# EAGLE schematic Sensor Board@0d0ac80375c143579a8476edc31a75d1 (EAGLE 6.4)

## Sheet 1 of 7: Microcontroller
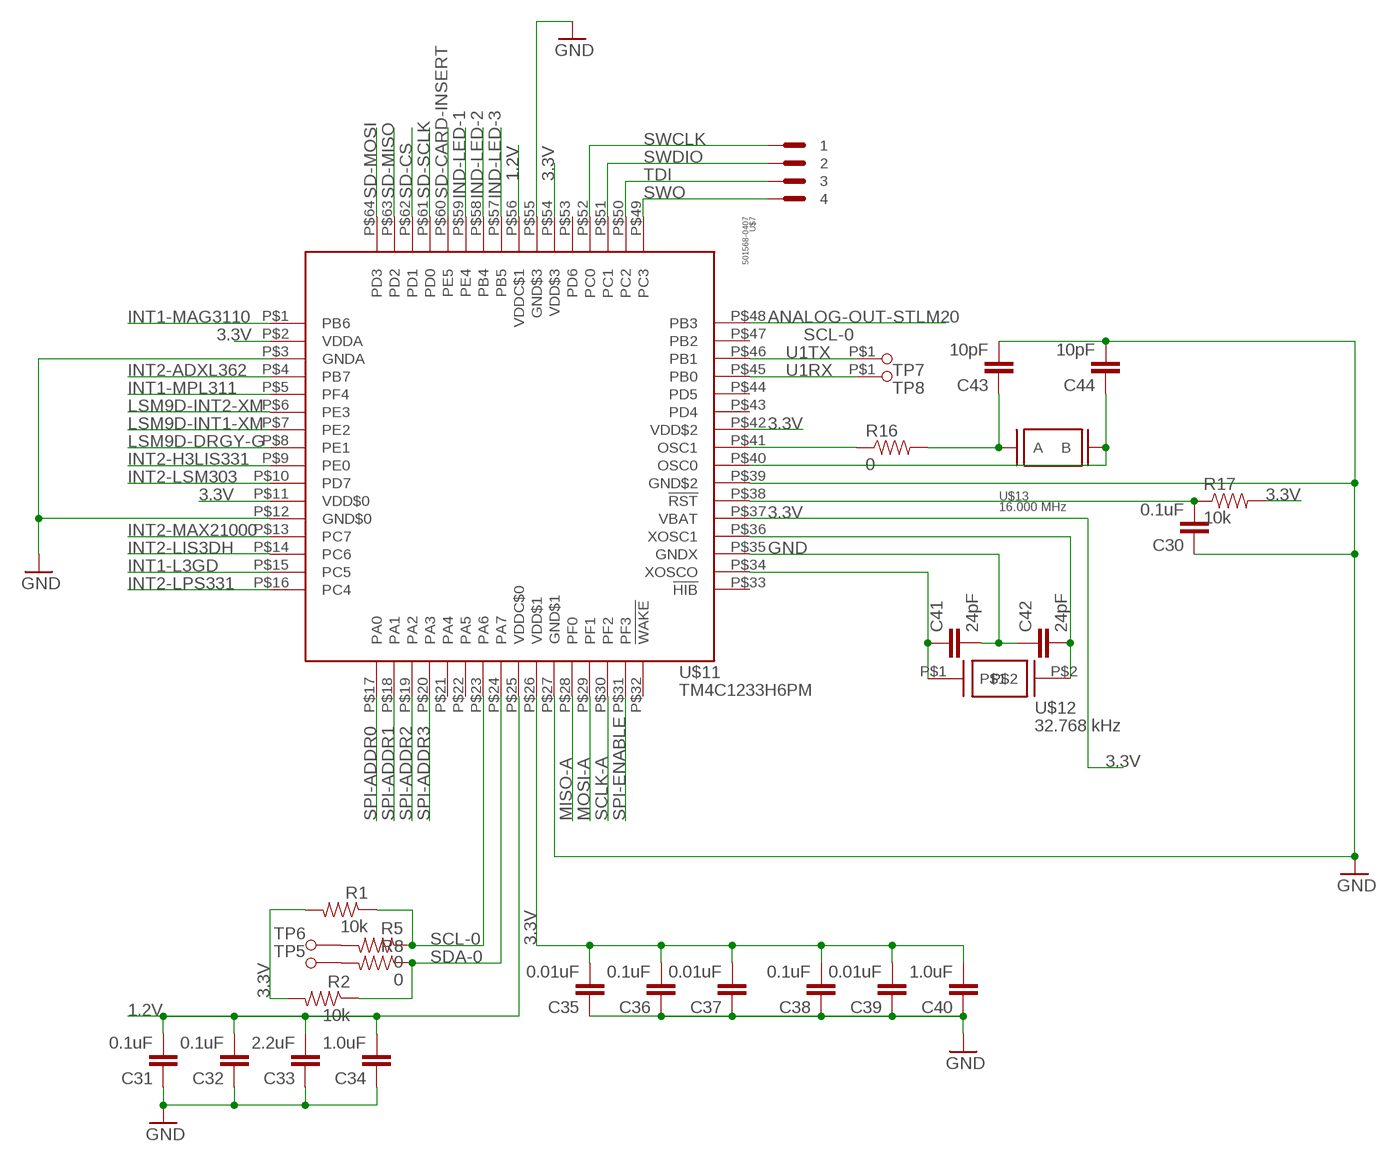
[diagram p0: schematic, sheet 1]

### Parts
C30  0.1uF  CAPACITOR0402  [C0402]
C31  0.1uF  CAPACITOR0402  [C0402]
C32  0.1uF  CAPACITOR0402  [C0402]
C33  2.2uF  CAPACITOR0402  [C0402]
C34  1.0uF  CAPACITOR0402  [C0402]
C35  0.01uF  CAPACITOR0402  [C0402]
C36  0.1uF  CAPACITOR0402  [C0402]
C37  0.01uF  CAPACITOR0402  [C0402]
C38  0.1uF  CAPACITOR0402  [C0402]
C39  0.01uF  CAPACITOR0402  [C0402]
C40  1.0uF  CAPACITOR0402  [C0402]
C41  24pF  CAPACITOR0402  [C0402]
C42  24pF  CAPACITOR0402  [C0402]
C43  10pF  CAPACITOR0402  [C0402]
C44  10pF  CAPACITOR0402  [C0402]
R1  10k  RESISTOR  [R0402]
R2  10k  RESISTOR  [R0402]
R5  0  RESISTOR  [R0402]
R8  0  RESISTOR  [R0402]
R16  0  RESISTOR  [R0402]
R17  10k  RESISTOR  [R0402]
TP5  TESTPAD(ROUND)  [TESTPAD(ROUND)]
TP6  TESTPAD(ROUND)  [TESTPAD(ROUND)]
TP7  TESTPAD(ROUND)  [TESTPAD(ROUND)]
TP8  TESTPAD(ROUND)  [TESTPAD(ROUND)]
U$7  501568-0407  [501568-0407]
U$11  TM4C1233H6PM  [S-PQFP-G64]
U$12  32.768 kHz  ABS07L  [2-SMD(3.2X1.5)]
U$13  16.000 MHz  NX3225GA  [4-SMD(3.2X2.5)]

### Nets
1.2V: C31.2 C32.2 C33.2 C34.2 U$11.P$25(VDDC$0) U$11.P$56(VDDC$1) ; also sheet 7
3.3V: C35.2 C36.2 C37.2 C38.2 C39.2 C40.2 R1.2 R2.2 R17.2 U$11.P$2(VDDA) U$11.P$11(VDD$0) U$11.P$26(VDD$1) U$11.P$37(VBAT) U$11.P$42(VDD$2) U$11.P$54(VDD$3) ; also sheet 2,3,4,5,6,7
ANALOG-OUT-STLM20: U$11.P$48(PB3) ; also sheet 4
GND: C30.1 C31.1 C32.1 C33.1 C34.1 C35.1 C36.1 C37.1 C38.1 C39.1 C40.1 C41.2 C42.1 C43.2 C44.2 U$11.P$3(GNDA) U$11.P$12(GND$0) U$11.P$27(GND$1) U$11.P$35(GNDX) U$11.P$39(GND$2) U$11.P$55(GND$3) ; also sheet 2,3,4,5,6,7
IND-LED-1: U$11.P$59(PE4) ; also sheet 7
IND-LED-2: U$11.P$58(PB4) ; also sheet 7
IND-LED-3: U$11.P$57(PB5) ; also sheet 7
INT1-L3GD: U$11.P$15(PC5) ; also sheet 3
INT1-MAG3110: U$11.P$1(PB6) ; also sheet 3
INT1-MPL311: U$11.P$5(PF4) ; also sheet 4
INT2-ADXL362: U$11.P$4(PB7) ; also sheet 2
INT2-H3LIS331: U$11.P$9(PE0) ; also sheet 2
INT2-LIS3DH: U$11.P$14(PC6) ; also sheet 2
INT2-LPS331: U$11.P$16(PC4) ; also sheet 4
INT2-LSM303: U$11.P$10(PD7) ; also sheet 3
INT2-MAX21000: U$11.P$13(PC7) ; also sheet 3
LSM9D-DRGY-G: U$11.P$8(PE1) ; also sheet 5
LSM9D-INT1-XM: U$11.P$7(PE2) ; also sheet 5
LSM9D-INT2-XM: U$11.P$6(PE3) ; also sheet 5
MISO-A: U$11.P$28(PF0) ; also sheet 6
MOSI-A: U$11.P$29(PF1) ; also sheet 6
N$10: C30.2 R17.1 U$11.P$38(!RST)
N$11: C42.2 U$11.P$36(XOSC1) U$12.P$2
N$12: C41.1 U$11.P$34(XOSCO) U$12.P$1
N$14: C43.1 R16.2 U$13.P$1(A)
N$16: C44.1 U$11.P$40(OSC0) U$13.P$3(B)
N$17: R16.1 U$11.P$41(OSC1)
N$24: R5.2 TP6.P$1
N$26: R8.2 TP5.P$1
SCL-0: R1.1 R5.1 U$11.P$23(PA6) ; also sheet 3,4,5
SCLK-A: U$11.P$30(PF2) ; also sheet 6
SD-CARD-INSERT: U$11.P$60(PE5) ; also sheet 6
SD-CS: U$11.P$62(PD1) ; also sheet 6
SD-MISO: U$11.P$63(PD2) ; also sheet 6
SD-MOSI: U$11.P$64(PD3) ; also sheet 6
SD-SCLK: U$11.P$61(PD0) ; also sheet 6
SDA-0: R2.1 R8.1 U$11.P$24(PA7) ; also sheet 3,4,5
SPI-ADDR0: U$11.P$17(PA0) ; also sheet 6
SPI-ADDR1: U$11.P$18(PA1) ; also sheet 6
SPI-ADDR2: U$11.P$19(PA2) ; also sheet 6
SPI-ADDR3: U$11.P$20(PA3) ; also sheet 6
SPI-ENABLE: U$11.P$31(PF3) ; also sheet 6
SWCLK: U$7.P$1 U$11.P$52(PC0)
SWDIO: U$7.P$2 U$11.P$51(PC1)
SWO: U$7.P$4 U$11.P$49(PC3)
TDI: U$7.P$3 U$11.P$50(PC2)
U1RX: TP8.P$1 U$11.P$45(PB0)
U1TX: TP7.P$1 U$11.P$46(PB1)
Unconnected: U$11.P$21(PA4) U$11.P$22(PA5) U$11.P$32(!WAKE) U$11.P$33(!HIB) U$11.P$43(PD4) U$11.P$44(PD5) U$11.P$47(PB2) U$11.P$53(PD6)

## Sheet 2 of 7: Accelerometer
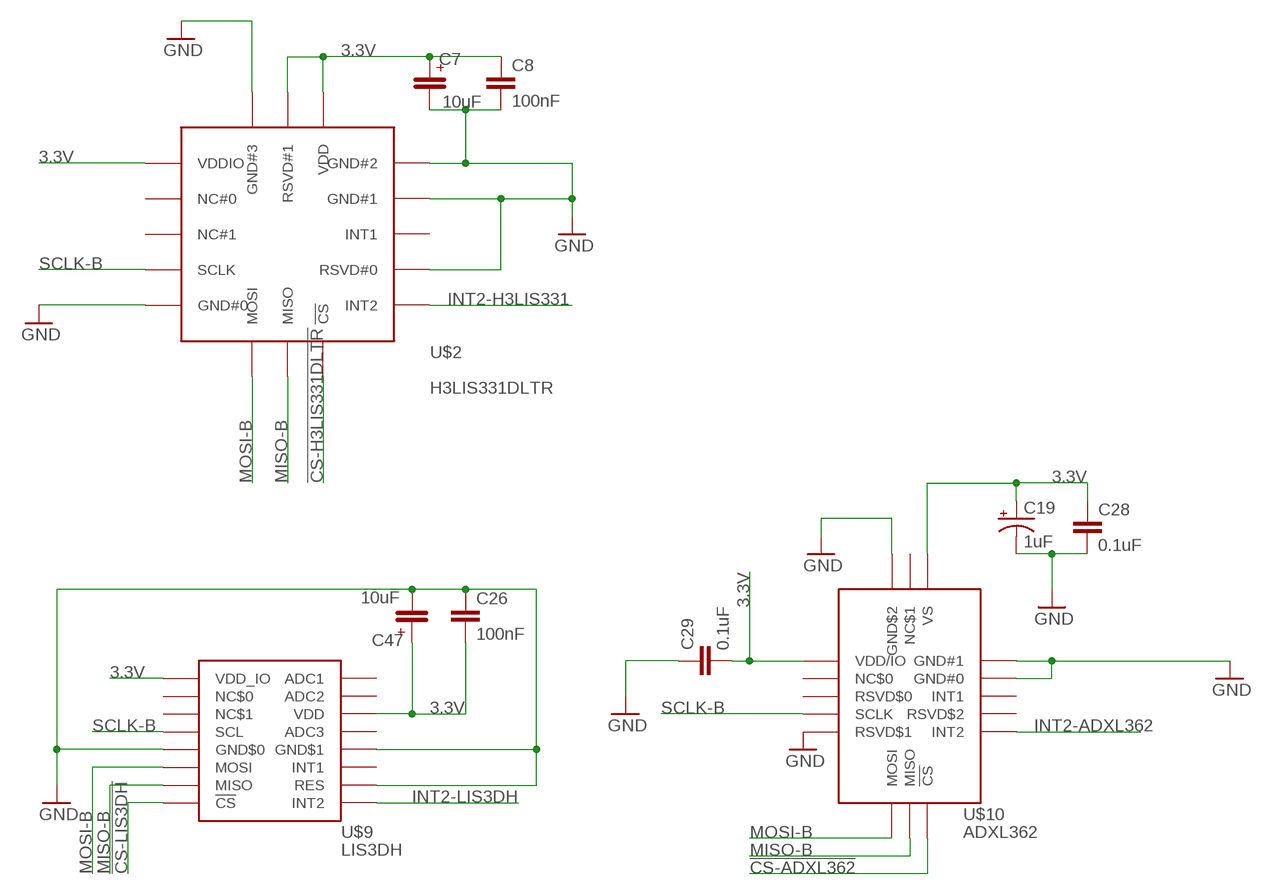
[diagram p1: schematic, sheet 2]

### Parts
C7  10uF  EEFCD0J100ER  [4.3X7.3SMD]
C8  100nF  CAPACITOR0402  [C0402]
C19  1uF  CAP_POL6032  [EIA6032]
C26  100nF  CAPACITOR0402  [C0402]
C28  0.1uF  CAPACITOR0402  [C0402]
C29  0.1uF  CAPACITOR0402  [C0402]
C47  10uF  EEFCD0J100ER  [4.3X7.3SMD]
U$2  H3LIS331DLTR  [LGA-16(3X3)]
U$9  LIS3DH  [LGA-16(3X3)]
U$10  ADXL362  [LGA-16(3X3.25)]

### Nets
3.3V: C7.P$1 C8.1 C19.P$1(+) C26.2 C28.1 C29.2 C47.P$1 U$2.P$1(VDDIO) U$2.P$14(VDD) U$2.P$15(RSVD#1) U$9.P$1(VDD_IO) U$9.P$14(VDD) U$10.P$1(VDD/IO) U$10.P$14(VS) ; also sheet 1,3,4,5,6,7
!CS-ADXL362: U$10.P$8(!CS) ; also sheet 6
!CS-H3LIS331DLTR: U$2.P$8(!CS) ; also sheet 6
!CS-LIS3DH: U$9.P$8(!CS) ; also sheet 6
GND: C7.P$2 C8.2 C19.P$2(-) C26.1 C28.2 C29.1 C47.P$2 U$2.P$5(GND#0) U$2.P$10(RSVD#0) U$2.P$12(GND#1) U$2.P$13(GND#2) U$2.P$16(GND#3) U$9.P$5(GND$0) U$9.P$10(RES) U$9.P$12(GND$1) U$10.P$5(RSVD$1) U$10.P$12(GND#0) U$10.P$13(GND#1) U$10.P$16(GND$2) ; also sheet 1,3,4,5,6,7
INT2-ADXL362: U$10.P$9(INT2) ; also sheet 1
INT2-H3LIS331: U$2.P$9(INT2) ; also sheet 1
INT2-LIS3DH: U$9.P$9(INT2) ; also sheet 1
MISO-B: U$2.P$7(MISO) U$9.P$7(MISO) U$10.P$7(MISO) ; also sheet 3,4,5,6
MOSI-B: U$2.P$6(MOSI) U$9.P$6(MOSI) U$10.P$6(MOSI) ; also sheet 3,4,5,6
SCLK-B: U$2.P$4(SCLK) U$9.P$4(SCL) U$10.P$4(SCLK) ; also sheet 3,4,5,6
Unconnected: U$2.P$2(NC#0) U$2.P$3(NC#1) U$2.P$11(INT1) U$9.P$2(NC$0) U$9.P$3(NC$1) U$9.P$11(INT1) U$9.P$13(ADC3) U$9.P$15(ADC2) U$9.P$16(ADC1) U$10.P$2(NC$0) U$10.P$3(RSVD$0) U$10.P$10(RSVD$2) U$10.P$11(INT1) U$10.P$15(NC$1)

## Sheet 3 of 7: Gyroscopic / Magnetic Sesnors
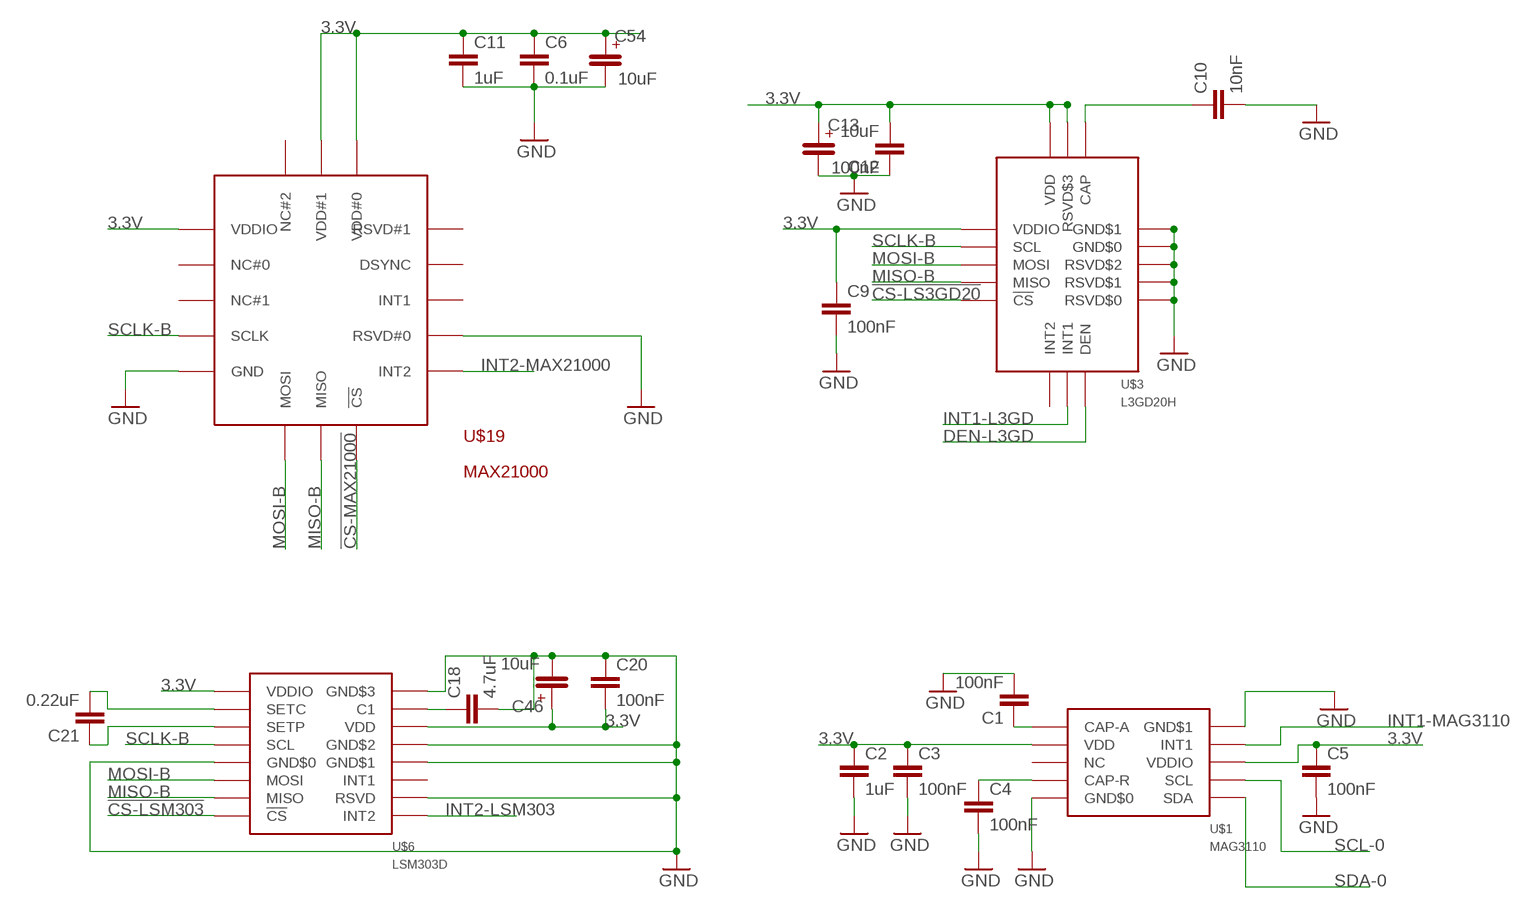
[diagram p2: schematic, sheet 3]

### Parts
C1  100nF  CAPACITOR0402  [C0402]
C2  1uF  CAPACITOR0402  [C0402]
C3  100nF  CAPACITOR0402  [C0402]
C4  100nF  CAPACITOR0402  [C0402]
C5  100nF  CAPACITOR0402  [C0402]
C6  0.1uF  CAPACITOR0402  [C0402]
C9  100nF  CAPACITOR0402  [C0402]
C10  10nF  CAPACITOR0402  [C0402]
C11  1uF  CAPACITOR0402  [C0402]
C12  10uF  CAPACITOR0402  [C0402]
C13  100nF  EEFCD0J100ER  [4.3X7.3SMD]
C18  4.7uF  CAPACITOR0402  [C0402]
C20  100nF  CAPACITOR0402  [C0402]
C21  0.22uF  CAPACITOR0402  [C0402]
C46  10uF  EEFCD0J100ER  [4.3X7.3SMD]
C54  10uF  EEFCD0J100ER  [4.3X7.3SMD]
U$1  MAG3110  [DFN-10(2X2)]
U$3  L3GD20H  [LGA-16(3X3)]
U$6  LSM303D  [LGA-16(3X3)]
U$19  MAX21000  [LGA-16(3X3)]

### Nets
3.3V: C2.1 C3.1 C5.1 C6.1 C9.1 C11.1 C12.2 C13.P$1 C20.2 C46.P$1 C54.P$1 U$1.P$2(VDD) U$1.P$8(VDDIO) U$3.P$1(VDDIO) U$3.P$15(RSVD$3) U$3.P$16(VDD) U$6.P$1(VDDIO) U$6.P$14(VDD) U$19.P$1(VDDIO) U$19.P$14(VDD#0) U$19.P$15(VDD#1) ; also sheet 1,2,4,5,6,7
!CS-LS3GD20: U$3.P$5(!CS) ; also sheet 6
!CS-LSM303: U$6.P$8(!CS) ; also sheet 6
!CS-MAX21000: U$19.P$8(!CS) ; also sheet 6
DEN-L3GD: U$3.P$8(DEN)
GND: C1.2 C2.2 C3.2 C4.2 C5.2 C6.2 C9.2 C10.2 C11.2 C12.1 C13.P$2 C18.2 C20.1 C46.P$2 C54.P$2 U$1.P$5(GND$0) U$1.P$10(GND$1) U$3.P$9(RSVD$0) U$3.P$10(RSVD$1) U$3.P$11(RSVD$2) U$3.P$12(GND$0) U$3.P$13(GND$1) U$6.P$5(GND$0) U$6.P$10(RSVD) U$6.P$12(GND$1) U$6.P$13(GND$2) U$6.P$16(GND$3) U$19.P$5(GND) U$19.P$10(RSVD#0) ; also sheet 1,2,4,5,6,7
INT1-L3GD: U$3.P$7(INT1) ; also sheet 1
INT1-MAG3110: U$1.P$9(INT1) ; also sheet 1
INT2-LSM303: U$6.P$9(INT2) ; also sheet 1
INT2-MAX21000: U$19.P$9(INT2) ; also sheet 1
MISO-B: U$3.P$4(MISO) U$6.P$7(MISO) U$19.P$7(MISO) ; also sheet 2,4,5,6
MOSI-B: U$3.P$3(MOSI) U$6.P$6(MOSI) U$19.P$6(MOSI) ; also sheet 2,4,5,6
N$1: C1.1 U$1.P$1(CAP-A)
N$3: C4.1 U$1.P$4(CAP-R)
N$4: C10.1 U$3.P$14(CAP)
N$6: C18.1 U$6.P$15(C1)
N$7: C21.2 U$6.P$2(SETC)
N$15: C21.1 U$6.P$3(SETP)
SCL-0: U$1.P$7(SCL) ; also sheet 1,4,5
SCLK-B: U$3.P$2(SCL) U$6.P$4(SCL) U$19.P$4(SCLK) ; also sheet 2,4,5,6
SDA-0: U$1.P$6(SDA) ; also sheet 1,4,5
Unconnected: U$1.P$3(NC) U$3.P$6(INT2) U$6.P$11(INT1) U$19.P$2(NC#0) U$19.P$3(NC#1) U$19.P$11(INT1) U$19.P$12(DSYNC) U$19.P$13(RSVD#1) U$19.P$16(NC#2)

## Sheet 4 of 7: Pressure / Temerature Sensors
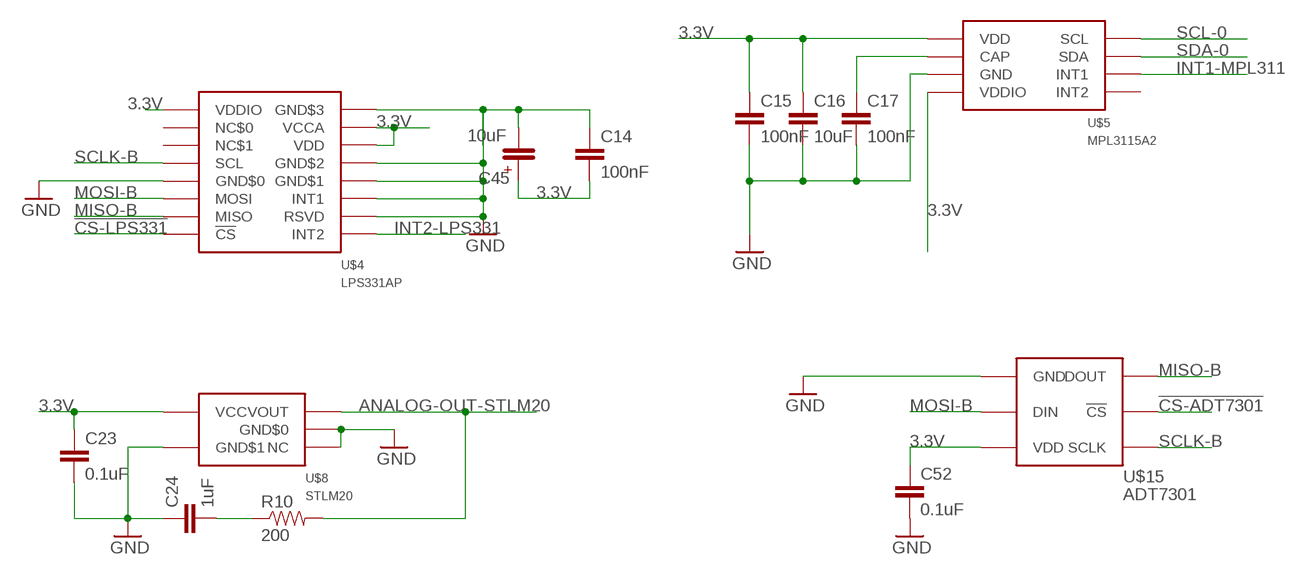
[diagram p3: schematic, sheet 4]

### Parts
C14  100nF  CAPACITOR0402  [C0402]
C15  100nF  CAPACITOR0402  [C0402]
C16  10uF  CAPACITOR0402  [C0402]
C17  100nF  CAPACITOR0402  [C0402]
C23  0.1uF  CAPACITOR0402  [C0402]
C24  1uF  CAPACITOR0402  [C0402]
C45  10uF  EEFCD0J100ER  [4.3X7.3SMD]
C52  0.1uF  CAPACITOR0402  [C0402]
R10  200  RESISTOR  [R0402]
U$4  LPS331AP  [LGA-16(3X3)]
U$5  MPL3115A2  [LGA-8(5X3)]
U$8  STLM20  [SOT323-5L]
U$15  ADT7301  [SOT23-6]

### Nets
3.3V: C14.2 C15.1 C16.1 C23.1 C45.P$1 C52.1 U$4.P$1(VDDIO) U$4.P$14(VDD) U$4.P$15(VCCA) U$5.P$1(VDD) U$5.P$4(VDDIO) U$8.P$4(VCC) U$15.P$3(VDD) ; also sheet 1,2,3,5,6,7
!CS-ADT7301: U$15.P$5(!CS) ; also sheet 6
!CS-LPS331: U$4.P$8(!CS) ; also sheet 6
ANALOG-OUT-STLM20: R10.2 U$8.P$3(VOUT) ; also sheet 1
GND: C14.1 C15.2 C16.2 C17.2 C23.2 C24.1 C45.P$2 C52.2 U$4.P$5(GND$0) U$4.P$10(RSVD) U$4.P$11(INT1) U$4.P$12(GND$1) U$4.P$13(GND$2) U$4.P$16(GND$3) U$5.P$3(GND) U$8.P$1(NC) U$8.P$2(GND$0) U$8.P$5(GND$1) U$15.P$1(GND) ; also sheet 1,2,3,5,6,7
INT1-MPL311: U$5.P$6(INT1) ; also sheet 1
INT2-LPS331: U$4.P$9(INT2) ; also sheet 1
MISO-B: U$4.P$7(MISO) U$15.P$6(DOUT) ; also sheet 2,3,5,6
MOSI-B: U$4.P$6(MOSI) U$15.P$2(DIN) ; also sheet 2,3,5,6
N$5: C17.1 U$5.P$2(CAP)
N$9: C24.2 R10.1
SCL-0: U$5.P$8(SCL) ; also sheet 1,3,5
SCLK-B: U$4.P$4(SCL) U$15.P$4(SCLK) ; also sheet 2,3,5,6
SDA-0: U$5.P$7(SDA) ; also sheet 1,3,5
Unconnected: U$4.P$2(NC$0) U$4.P$3(NC$1) U$5.P$5(INT2)

## Sheet 5 of 7: 9D Sensor / Humidity Sensor
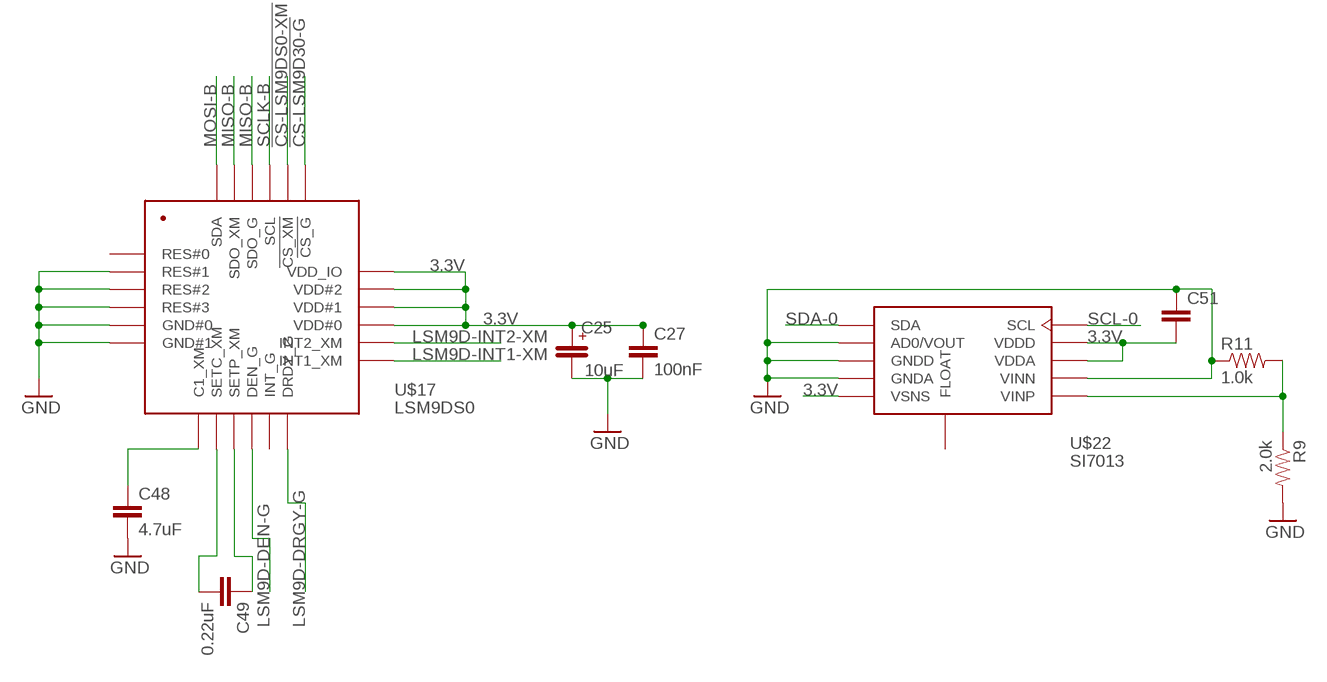
[diagram p4: schematic, sheet 5]

### Parts
C25  10uF  EEFCD0J100ER  [4.3X7.3SMD]
C27  100nF  CAPACITOR0402  [C0402]
C48  4.7uF  CAPACITOR0402  [C0402]
C49  0.22uF  CAPACITOR0402  [C0402]
C51  CAPACITOR0402  [C0402]
R9  2.0k  RESISTOR  [R0402]
R11  1.0k  RESISTOR  [R0402]
U$17  LSM9DS0  [LGA-24(4X4)]
U$22  SI7013  [DFN-10(3X3)]

### Nets
3.3V: C25.P$1 C27.1 C51.2 U$17.P$15(VDD#0) U$17.P$16(VDD#1) U$17.P$17(VDD#2) U$17.P$18(VDD_IO) U$22.P$5(VSNS) U$22.P$8(VDDA) U$22.P$9(VDDD) ; also sheet 1,2,3,4,6,7
!CS-LSM9D30-G: U$17.P$19(!CS_G) ; also sheet 6
!CS-LSM9DS0-XM: U$17.P$20(!CS_XM) ; also sheet 6
GND: C25.P$2 C27.2 C48.2 C51.1 R9.2 R11.1 U$17.P$2(RES#1) U$17.P$3(RES#2) U$17.P$4(RES#3) U$17.P$5(GND#0) U$17.P$6(GND#1) U$22.P$2(AD0/VOUT) U$22.P$3(GNDD) U$22.P$4(GNDA) U$22.P$7(VINN) ; also sheet 1,2,3,4,6,7
LSM9D-DEN-G: U$17.P$10(DEN_G)
LSM9D-DRGY-G: U$17.P$12(DRDY_G) ; also sheet 1
LSM9D-INT1-XM: U$17.P$13(INT1_XM) ; also sheet 1
LSM9D-INT2-XM: U$17.P$14(INT2_XM) ; also sheet 1
MISO-B: U$17.P$22(SDO_G) U$17.P$23(SDO_XM) ; also sheet 2,3,4,6
MOSI-B: U$17.P$24(SDA) ; also sheet 2,3,4,6
N$8: C48.1 U$17.P$7(C1_XM)
N$18: R9.1 R11.2 U$22.P$6(VINP)
N$21: C49.2 U$17.P$8(SETC_XM)
N$22: C49.1 U$17.P$9(SETP_XM)
SCL-0: U$22.P$10(SCL) ; also sheet 1,3,4
SCLK-B: U$17.P$21(SCL) ; also sheet 2,3,4,6
SDA-0: U$22.P$1(SDA) ; also sheet 1,3,4
Unconnected: U$17.P$1(RES#0) U$17.P$11(INT_G) U$22.P$11(FLOAT)

## Sheet 6 of 7: SPI/SD Comunication
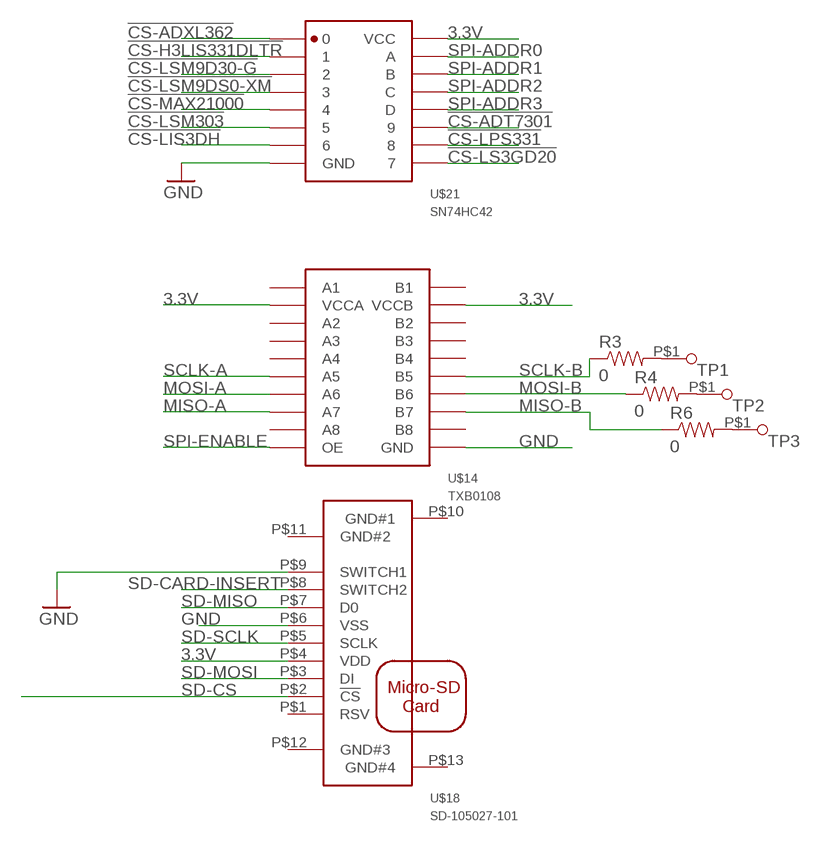
[diagram p5: schematic, sheet 6]

### Parts
R3  0  RESISTOR  [R0402]
R4  0  RESISTOR  [R0402]
R6  0  RESISTOR  [R0402]
TP1  TESTPAD(ROUND)  [TESTPAD(ROUND)]
TP2  TESTPAD(ROUND)  [TESTPAD(ROUND)]
TP3  TESTPAD(ROUND)  [TESTPAD(ROUND)]
U$14  TXB0108  [TSSOP-(PW)-20]
U$18  SD-105027-101  [SD-105027-1001]
U$21  SN74HC42  [SOIC-16]

### Nets
3.3V: U$14.P$2(VCCA) U$14.P$19(VCCB) U$18.P$4(VDD) U$21.P$16(VCC) ; also sheet 1,2,3,4,5,7
!CS-ADT7301: U$21.P$11 ; also sheet 4
!CS-ADXL362: U$21.P$1 ; also sheet 2
!CS-H3LIS331DLTR: U$21.P$2 ; also sheet 2
!CS-LIS3DH: U$21.P$7 ; also sheet 2
!CS-LPS331: U$21.P$10 ; also sheet 4
!CS-LS3GD20: U$21.P$9 ; also sheet 3
!CS-LSM9D30-G: U$21.P$3 ; also sheet 5
!CS-LSM9DS0-XM: U$21.P$4 ; also sheet 5
!CS-LSM303: U$21.P$6 ; also sheet 3
!CS-MAX21000: U$21.P$5 ; also sheet 3
GND: U$14.P$11(GND) U$18.P$6(VSS) U$18.P$9(SWITCH1) U$21.P$8(GND) ; also sheet 1,2,3,4,5,7
MISO-A: U$14.P$8(A7) ; also sheet 1
MISO-B: R6.1 U$14.P$13(B7) ; also sheet 2,3,4,5
MOSI-A: U$14.P$7(A6) ; also sheet 1
MOSI-B: R4.1 U$14.P$14(B6) ; also sheet 2,3,4,5
N$32: R3.2 TP1.P$1
N$33: R4.2 TP2.P$1
N$34: R6.2 TP3.P$1
SCLK-A: U$14.P$6(A5) ; also sheet 1
SCLK-B: R3.1 U$14.P$15(B5) ; also sheet 2,3,4,5
SD-CARD-INSERT: U$18.P$8(SWITCH2) ; also sheet 1
SD-CS: U$18.P$2(!CS) ; also sheet 1
SD-MISO: U$18.P$7(D0) ; also sheet 1
SD-MOSI: U$18.P$3(DI) ; also sheet 1
SD-SCLK: U$18.P$5(SCLK) ; also sheet 1
SPI-ADDR0: U$21.P$15(A) ; also sheet 1
SPI-ADDR1: U$21.P$14(B) ; also sheet 1
SPI-ADDR2: U$21.P$13(C) ; also sheet 1
SPI-ADDR3: U$21.P$12(D) ; also sheet 1
SPI-ENABLE: U$14.P$10(OE) ; also sheet 1
Unconnected: U$14.P$1(A1) U$14.P$3(A2) U$14.P$4(A3) U$14.P$5(A4) U$14.P$9(A8) U$14.P$12(B8) U$14.P$16(B4) U$14.P$17(B3) U$14.P$18(B2) U$14.P$20(B1) U$18.P$1(RSV) U$18.P$10(GND#1) U$18.P$11(GND#2) U$18.P$12(GND#3) U$18.P$13(GND#4)

## Sheet 7 of 7: Power / Indicator LEDs
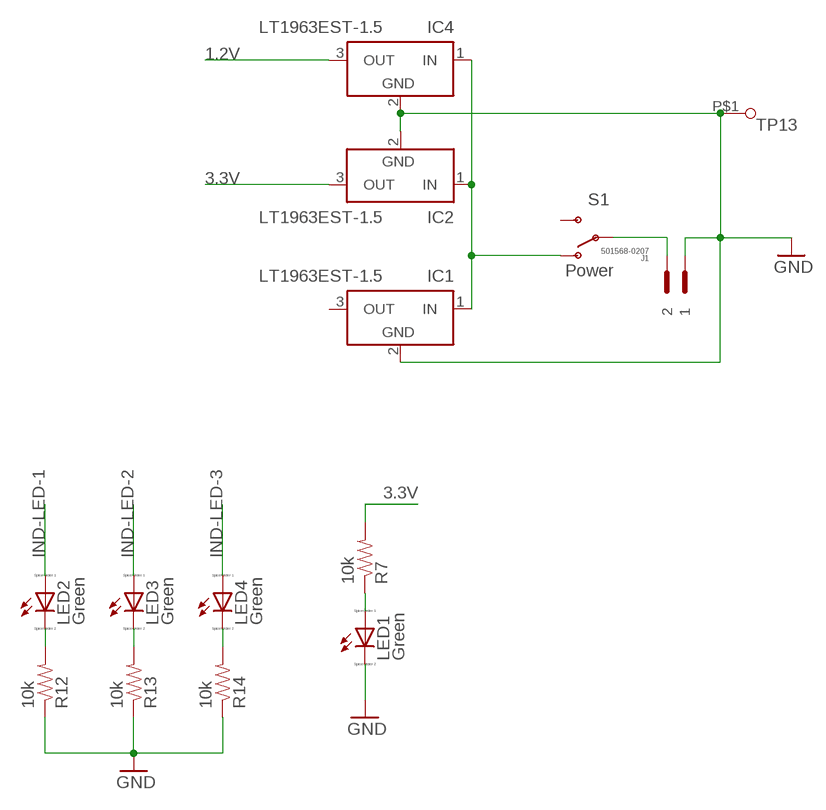
[diagram p6: schematic, sheet 7]

### Parts
IC1  LT1963EST-1.5  [SOT223]
IC2  LT1963EST-1.5  [SOT223]
IC4  LT1963EST-1.5  [SOT223]
J1  501568-0207  [501568-0207]
LED1  Green  LED_ESML0603  [LED_SML0603]
LED2  Green  LED_ESML0603  [LED_SML0603]
LED3  Green  LED_ESML0603  [LED_SML0603]
LED4  Green  LED_ESML0603  [LED_SML0603]
R7  10k  RESISTOR  [R0402]
R12  10k  RESISTOR  [R0402]
R13  10k  RESISTOR  [R0402]
R14  10k  RESISTOR  [R0402]
S1  Power  SWITCH-SPDT-SMD-A  [SWITCH-SPST-SMD-A]
TP13  TESTPAD(ROUND)  [TESTPAD(ROUND)]

### Nets
1.2V: IC4.3(OUT) ; also sheet 1
3.3V: IC2.3(OUT) R7.2 ; also sheet 1,2,3,4,5,6
GND: IC1.2(GND) IC2.2(GND) IC4.2(GND) J1.P$1 LED1.C R12.1 R13.1 R14.1 TP13.P$1 ; also sheet 1,2,3,4,5,6
IND-LED-1: LED2.A ; also sheet 1
IND-LED-2: LED3.A ; also sheet 1
IND-LED-3: LED4.A ; also sheet 1
N$19: J1.P$2 S1.2(P)
N$23: IC1.1(IN) IC2.1(IN) IC4.1(IN) S1.1(O)
N$27: LED1.A R7.1
N$29: LED4.C R14.2
N$31: LED3.C R13.2
N$35: LED2.C R12.2
Unconnected: IC1.3(OUT) S1.3(S)

## Power pins joined to a net without a drawn wire
GND: IC1.4(GND) IC2.4(GND) IC4.4(GND)

## Library data of the parts
C1-C6 C8-C12 C14-C18 C20 C21 C23 C24 C26-C44 C48 C49 C51 C52 = Kas-Passives:CAPACITOR: Ceramic SMT Capacitor
C7 C13 C25 C45-C47 C54 = Kas-Passives:EEFCD0J100ER: ALU Capacitor
C19 = SparkFun-Passives:CAP_POL: Capacitor Polarized These are standard SMD and PTH capacitors. Normally 10uF, 47uF, and 100uF in electrolytic and tantalum varieties. Always verify the external diameter of the through hole cap, it varies with capacity, voltage, and manufacturer. The EIA devices should be standard.
IC1 IC2 IC4 = linear-technology:LT1963EST: 1.5A, Low Noise, Fast Transient Response LDO Regulator Source: http://www.linear.com/pc/downloadDocument.do?navId=H0,C3,P2222,D3148; MPN: LT1963EST-1.5; OC_FARNELL: 1663528; OC_NEWARK: 57M7534
J1 = Kas-Connectors:501568-0207: 1.00mm Pitch Pico-Clasp™ Wire-to-Board Header, Surface Mount, Single Row, Right Angle, with Friction Lock, 2 Circuits, Lead-Free
LED1-LED4 = eagle-ltspice:LED_E: LED Source: http://www.osram.convergy.de Source: www.luxeon.com Source: www.kingbright.com; SPICEMODEL: NONE; SPICEPREFIX: D; SPICETYPE: diode
R1-R14 R16 R17 = Kas-Passives:RESISTOR: 0402 Resistor
S1 = SparkFun-Electromechanical:SWITCH-SPDT: SPDT Switch Simple slide switch, Spark Fun Electronics SKU : COM-00102 DPDT SMT slide switch, AYZ0202, SWCH-08179
TP1-TP3 TP7 TP8 TP13 = Kas-Passives:TESTPAD(ROUND)
TP5 TP6 = Kas-Connectors:TESTPAD(ROUND): Rount SMD test point with a 2.8mm footprint
U$1 = Kas-Sensors:MAG3110: MAG3110 Magnotometer MAG3110: Xtrinsic High Accuracy, 3D Magnetometer
U$2 = Kas-Sensors:H3LIS331DLTR: H3LIS331DLTR Accelorometer MEMS motion sensor: low-power high-g 3-axis digital accelerometer
U$3 = Kas-Sensors:L3GD20H: L3GD20H Gyroscope MEMS motion sensor: three-axis digital output gyroscope
U$4 = Kas-Sensors:LPS331AP: LPS331AP Pressure sensor MEMS pressure sensor, 260-1260 mbar absolute digital output barometer
U$5 = Kas-Sensors:MPL3115A2: MPL3115A2 Pressure sensor MPL3115A2: 50 to 110kPa, 2.5v, Absolute Xtrinsic Smart Pressure Sensor
U$6 = Kas-Sensors:LSM303D: LSM303D Magitometer & Accelorometer Ultra compact high performance e-compass: 3D accelerometer and 3D magnetometer module
U$7 = Kas-Connectors:501568-0407: 1.00mm Pitch Pico-Clasp™ Wire-to-Board Header, Surface Mount, Single Row, Right Angle, with Friction Lock, 4 Circuits, Lead-Free
U$8 = Kas-Sensors:STLM20: STLM20 Temerature sensor Ultra-low current 2.4 V precision analog temperature sensor
U$9 = Kas-Sensors:LIS3DH: LIS3DH Accelorometer MEMS digital output motion sensor ultra low-power high performance 3-axes "nano" accelerometer
U$10 = Kas-Sensors:ADXL362: ADXL362 Accelorometer ADXL362: MICROPOWER, 3-AXIS, ±2 g/±4 g/±8 g DIGITAL OUTPUT MEMS ACCELEROMETER
U$11 = Kas-Microcontroller:TM4C1233H6PM: TM4C1233H6PM in a 10.2x10.2 S-PQFP-G64 package
U$12 = Kas-Crystal:ABS07L: SMD Ultra Low Profile Crystal, 32.768kHz LC (pF) 9, 7, 12.5 FT (ppm) 20, 30
U$13 = Kas-Crystal:NX3225GA: NX3225GA Crystal (16MHz, 25MHz)
U$14 = Kas-Buffers & Level Shifters:TXB0108
U$15 = Kas-Sensors:ADT7301: ADT7301 Temperature sensor ADT7301: 13-BIT, ±1ºC ACCURATE, MICROPOWER DIGITAL TEMPERATURE SENSOR IN 6-LEAD SOT-23 AND 8-LEAD MSOP
U$17 = Kas-Sensors:LSM9DS0: LSM9DS0 9D sensor iNEMO inertial module:3D accelerometer, 3D gyroscope, 3D magnetometer
U$18 = Kas-Connectors:SD-105027-101: 1.10mm, 0.76mm, 0.70mm Pitch microSD Card Header with Detect Switch (Pin 8), Height 1.70mm, Lead-Free, 0.102µm Gold (Au) Plating
U$19 = Kas-Sensors:MAX21000: MAX21000 Gyroscope Ultra-Accurate, Low Power, 3-Axis Digital Output Gyroscope
U$21 = Kas-Buffers & Level Shifters:SN74HC42: SN74HC42 in a SOIC-16 package (4:10 Decoder)
U$22 = Kas-Sensors:SI7013: Si7013 Humidity sensor ​Si7013 2nd Generation Relative Humidity and Temperature Sensors